# EAGLE design MySens-easyESP32-013 (EAGLE 7.6.0)
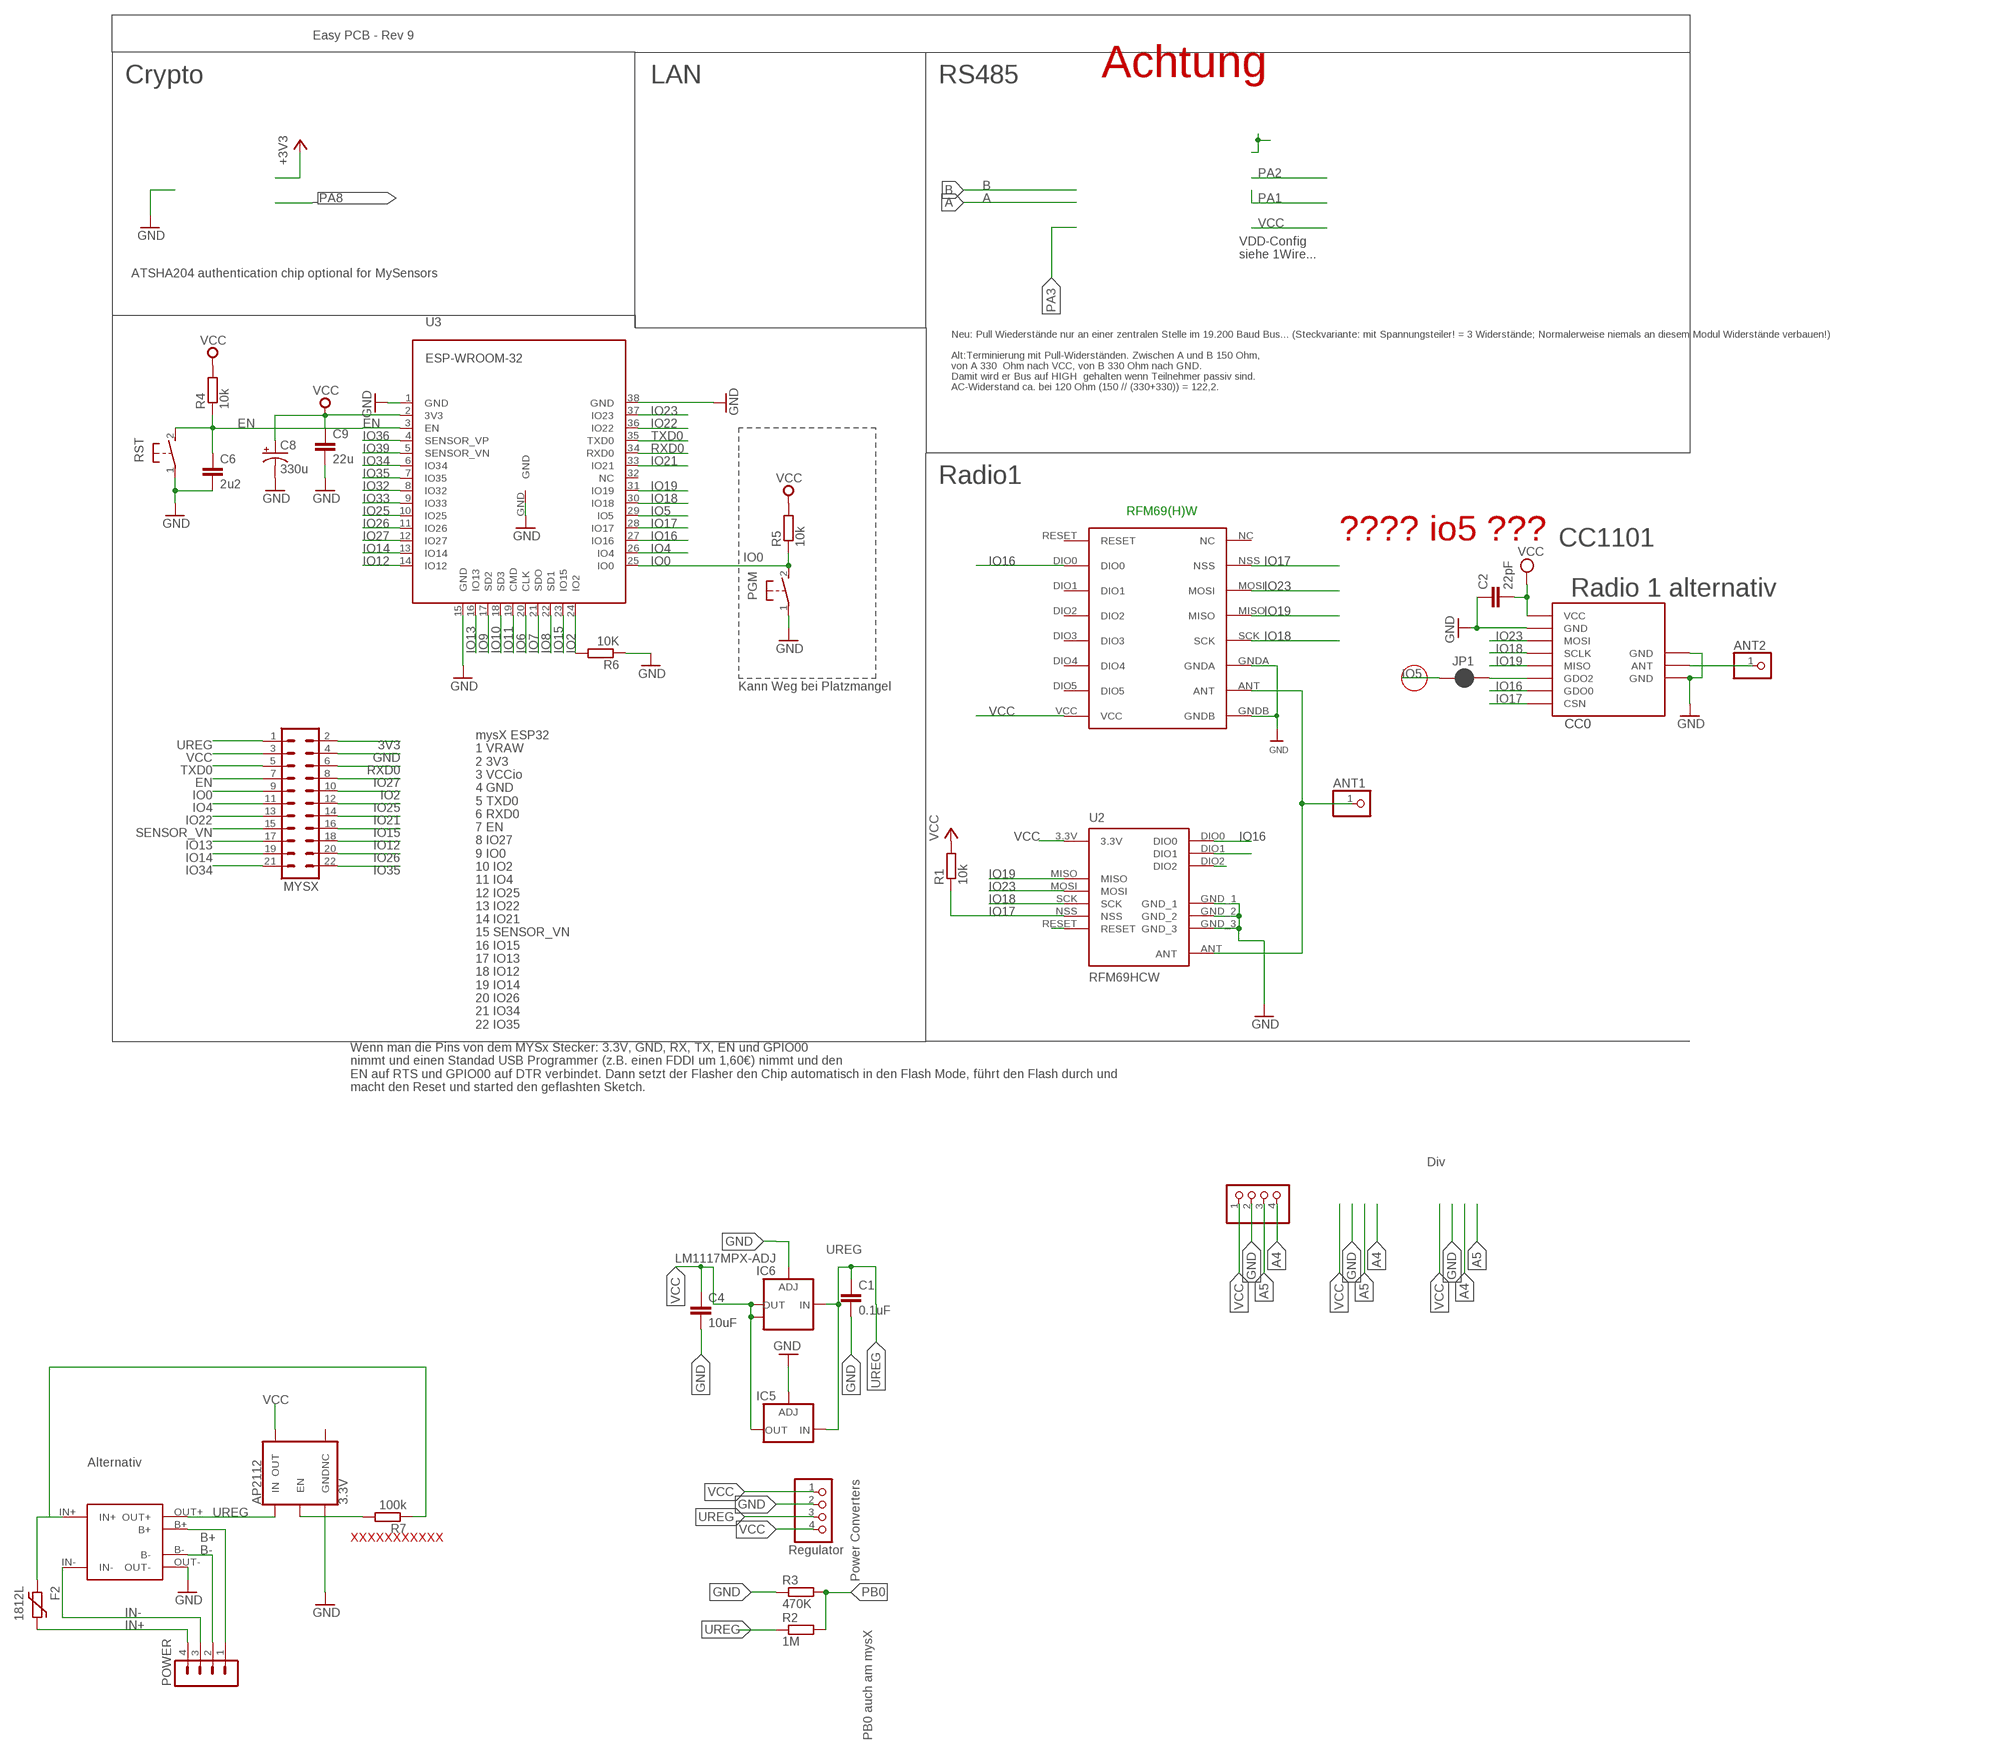
[diagram p0: schematic, sheet 1]

## Parts
ANT1  PINHD-1X1  [1X01]
ANT2  PINHD-1X1  [1X01]
AP2112  3.3V  V_REG_AP2112K-3.3V  [SOT23-5]
C1  0.1uF  C-EUC1206  [C1206]
C2  22pF  C-EUC0805  [C0805]
C4  10uF  C-EUC1210  [C1210]
C6  2u2  C-EUC0603  [C0603]
C8  330u  CAP_POLSMD  [VISHAY_C]
C9  22u  CAP0805  [0805]
CC0  CC1101  CC1101_MODULE1SMD  [CC1101_MODULE1_SMD]
F2  1812L  [1812L]
I2C-1  PINHD-1X04_2.54-S  [1X04-S]
IC5  LD117ADT50TR  [DPACK]
IC6  LM1117MPX-ADJ  [SOT223]
JP1  JUMPER-SMT_2_NC_PASTE_NO-SILK  [SMT-JUMPER_2_NC_PASTE_NO-SILK]
MYSX  MA11-2  [MA11-2]
PGM  DTSM-3  [DTSM-3]
POWER  MA04-1  [MA04-1]
R1  10k  R-EU_M0805  [M0805]
R2  1M  R-EU_R0805  [R0805]
R3  470K  R-EU_R0805  [R0805]
R4  10k  R-EU_R0603  [R0603]
R5  10k  R-EU_R0603  [R0603]
R6  10K  R-EU_R0603  [R0603]
R7  100k  R-EU_M0805  [M0805]
RFM69W1  RFM69HW  [RFM]
RST  DTSM-3  [DTSM-3]
STEPDWN  PINHD-1X04_2.54-S  [1X04-S]
TP4056  TP4056-MODULE  [TP4056-LITHIUM-PROTECTED-MODULE]
U2  RFM69HCW  [RFM69HCW-XXXS2]
U3  ESP-WROOM-32  [ESP-WROOM-32]

## Nets
3V3: MYSX.2 ; supply symbol labelled +3V3
A4: I2C-1.4
A5: I2C-1.3
ANT0: ANT2.1 CC0.ANT
ANT1: ANT1.1 RFM69W1.ANT U2.ANT
B+ [vcc]: POWER.1 TP4056.B+
B- [gnd]: POWER.2 TP4056.B-
EN: C6.1 MYSX.7 R4.1 RST.2 U3.3(EN)
GND [gnd]: AP2112.2(GND) C1.2 C2.1 C4.2 C6.2 C8.- C9.2 CC0.GND@0(GND) CC0.GND@1(GND) CC0.GND@2(GND) I2C-1.2 IC5.1(ADJ) IC6.1(ADJ) MYSX.4 PGM.1 R3.1 R6.1 RFM69W1.GNDA RFM69W1.GNDB RST.1 STEPDWN.2 TP4056.OUT- U2.GND_1 U2.GND_2 U2.GND_3 U3.1(GND) U3.15(GND) U3.38(GND) U3.GND
IN+ [vcc]: F2.P$2 POWER.4
IN- [gnd]: POWER.3 TP4056.IN-
IO0: MYSX.9 PGM.2 R5.1 U3.25(IO0)
IO2: MYSX.10 R6.2 U3.24(IO2)
IO4: MYSX.11 U3.26(IO4)
IO5: JP1.1 U3.29(IO5)
IO6: U3.20(CLK)
IO7: U3.21(SDO)
IO8: U3.22(SD1)
IO9: U3.17(SD2)
IO10: U3.18(SD3)
IO11: U3.19(CMD)
IO12: MYSX.18 U3.14(IO12)
IO13: MYSX.17 U3.16(IO13)
IO14: MYSX.19 U3.13(IO14)
IO15: MYSX.16 U3.23(IO15)
IO16: CC0.GDO0 RFM69W1.DIO0 U2.DIO0 U3.27(IO16)
IO17: CC0.CSN R1.1 RFM69W1.NSS U2.NSS U3.28(IO17)
IO18: CC0.SCLK RFM69W1.SCK U2.SCK U3.30(IO18)
IO19: CC0.MISO RFM69W1.MISO U2.MISO U3.31(IO19)
IO21: MYSX.14 U3.33(IO21)
IO22: MYSX.13 U3.36(IO22)
IO23: CC0.MOSI RFM69W1.MOSI U2.MOSI U3.37(IO23)
IO25: MYSX.12 U3.10(IO25)
IO26: MYSX.20 U3.11(IO26)
IO27: MYSX.8 U3.12(IO27)
IO32: U3.8(IO32)
IO33: U3.9(IO33)
IO34: MYSX.21 U3.6(IO34)
IO35: MYSX.22 U3.7(IO35)
IO36: U3.4(SENSOR_VP)
IO39: U3.5(SENSOR_VN)
MAYBE_IO5: CC0.GDO2 JP1.2
N$1: F2.P$1 R7.1 TP4056.IN+
N$4: U2.DIO2
N$8: U2.DIO1
N$9: U2.RESET
N$12: AP2112.3(EN) R7.2
PB0: R2.2 R3.2
RXD0: MYSX.6 U3.34(RXD0)
SENSOR_VN: MYSX.15
TXD0: MYSX.5 U3.35(TXD0)
UREG [gnd]: AP2112.1(IN) C1.1 IC5.3(IN) IC6.3(IN) MYSX.1 R2.1 STEPDWN.3 TP4056.OUT+
VCC [gnd]: AP2112.5(OUT) C2.2 C4.1 C8.+ C9.1 CC0.VCC I2C-1.1 IC5.4(OUT) IC6.2(OUT) IC6.TAB(OUT1) MYSX.3 R1.2 R4.2 R5.2 RFM69W1.VCC STEPDWN.1 STEPDWN.4 U2.3.3V U3.2(3V3)
Unconnected: AP2112.4(NC) RFM69W1.DIO1 RFM69W1.DIO2 RFM69W1.DIO3 RFM69W1.DIO4 RFM69W1.DIO5 RFM69W1.NC RFM69W1.RESET U3.32(NC)

## Notes on the sheet
- Easy PCB - Rev 9
- Crypto | LAN | RS485 | Achtung
- VDD-Config
  siehe 1Wire...
- ATSHA204 authentication chip optional for MySensors
- Neu: Pull Wiederstände nur an einer zentralen Stelle im 19.200 Baud Bus... (Steckvariante: mit Spannungsteiler! = 3 Widerstände; Normalerweise niemals an diesem Modul Widerstände verbauen!)
  
  Alt:Terminierung mit Pull-Widerständen. Zwischen A und B 150 Ohm,
  von A 330  Ohm nach VCC, von B 330 Ohm nach GND. 
  Damit wird er Bus auf HIGH  gehalten wenn Teilnehmer passiv sind.
  AC-Widerstand ca. bei 120 Ohm (150 // (330+330)) = 122,2.
- Radio1
- RFM69(H)W
- ???? io5 ??? | CC1101
- Radio 1 alternativ
- Kann Weg bei Platzmangel
- mysX ESP32
  1 VRAW
  2 3V3
  3 VCCio
  4 GND
  5 TXD0
  6 RXD0
  7 EN
  8 IO27
  9 IO0
  10 IO2
  11 IO4
  12 IO25
  13 IO22
  14 IO21
  15 SENSOR_VN
  16 IO15
  17 IO13
  18 IO12
  19 IO14
  20 IO26
  21 IO34
  22 IO35
- Wenn man die Pins von dem MYSx Stecker: 3.3V, GND, RX, TX, EN und GPIO00
  nimmt und einen Standad USB Programmer (z.B. einen FDDI um 1,60€) nimmt und den
  EN auf RTS und GPIO00 auf DTR verbindet. Dann setzt der Flasher den Chip automatisch in den Flash Mode, führt den Flash durch und
  macht den Reset und started den geflashten Sketch.
- Div
- Alternativ
- Power Converters
- XXXXXXXXXXX
- Regulator
- PB0 auch am mysX

## Library data of the parts
ANT1 ANT2 = pinhead:PINHD-1X1: PIN HEADER
AP2112 = SparkFun-IC-Power:V_REG_AP2112: AP2112 - 600mA CMOS LDO Regulator w/ Enable The AP2112 is CMOS process low dropout linear regulator with enable function, the regulator delivers a guaranteed 600mA (min.) continuous load current. Features Output Voltage Accuracy: ±1.5% Output Current: 600mA (Min.) Foldback Short Current Protection: 50mA Enable Function to Turn ON/OFF VOUT Low Dropout Voltage (3.3V): 250mV (Typ.) @IOUT=600mA Excellent Load Regulation: 0.2%/A (Typ.) Excellent Line Regulation: 0.02%/V (Typ.) Low Quiescent Current: 55μA (Typ.) Low Standby Current: 0.01μA (Typ.) Low Output Noise: 50μVRMS PSRR: 100Hz -65dB, 1kHz -65dB OTSD Protection Stable with 1.0μF Flexible Cap: Ceramic, Tantalum and Aluminum Electrolytic Operation Temperature Range: -40°C to 85°C ESD: MM 400V, HBM 4000V; PROD_ID: VREG-12457
C1 C2 C4 C6 = rcl:C-EU: CAPACITOR, European symbol
C8 = SparkFun-Passives:CAP_POL: Capacitor Polarized These are standard SMD and PTH capacitors. Normally 10uF, 47uF, and 100uF in electrolytic and tantalum varieties. Always verify the external diameter of the through hole cap, it varies with capacity, voltage, and manufacturer. The EIA devices should be standard.
C9 = SparkFun-Passives:CAP: Capacitor Standard 0603 ceramic capacitor, and 0.1" leaded capacitor.
CC0 = wireless:CC1101_MODULE1: CC1101 wireless module for 433/868 MHz (sold from Aliexpress). DIL version for mounting with pin header (and SMD soldering) and SMD only variant available.
F2 = ptc-littlefuse:1812L
I2C-1 STEPDWN = pinhead-2:PINHD-1X04: PIN HEADER
IC5 = v-reg:LD117A?*: Low drop fixed and adjustable positive voltage regulators 1 A Source: http://www.st.com/stonline/products/literature/ds/7194/ld1117axx.pdf
IC6 = lm1117:LM1117MPX-ADJ
JP1 = SparkFun-Jumpers:JUMPER-SMT_2_NC_PASTE: Normally closed solder jumper This jumper has an aperture in the stencil to allow solder paste to bridge the split in the wire so it's normally closed (NC). Wick off the solder to open the connection. Reapply solder to reclose the connection.
MYSX = con-Pinheader:MA11-2: PIN HEADER; OC_FARNELL: unknown; OC_NEWARK: unknown
PGM RST = switch-tact:DTSM-3
POWER = con-lstb:MA04-1: PIN HEADER; OC_FARNELL: unknown; OC_NEWARK: unknown
R1-R7 = rcl:R-EU_: RESISTOR, European symbol
RFM69W1 = hoperf:RFM69HW
TP4056 = tp2112-usw-V2:TP4056-MODULE
U2 = doug:RFM69H
U3 = esp32:ESP-WROOM-32

## Net classes
0 default: width 0.305 mm, clearance 0.205 mm
1 gnd: width 0.457 mm, drill 0.635 mm, clearance 0.254 mm
2 vcc: width 0.406 mm, drill 0.406 mm, clearance 0.254 mm

## Board
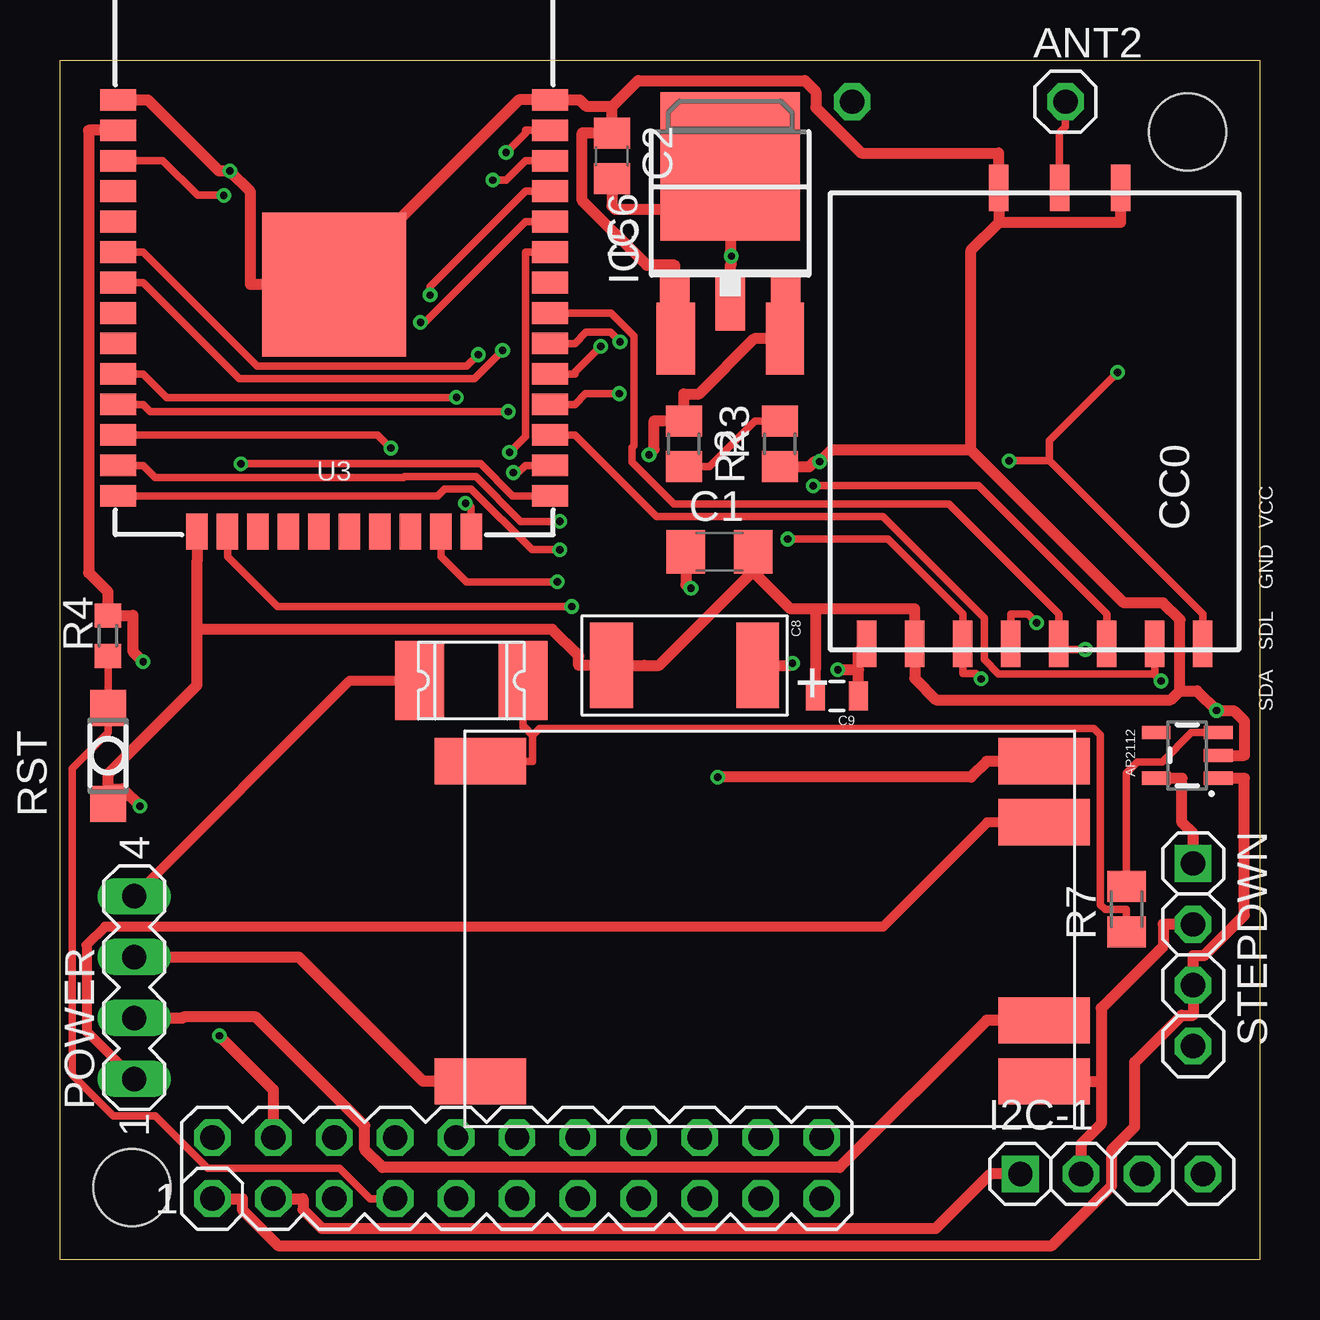
[diagram p1: board, top side]
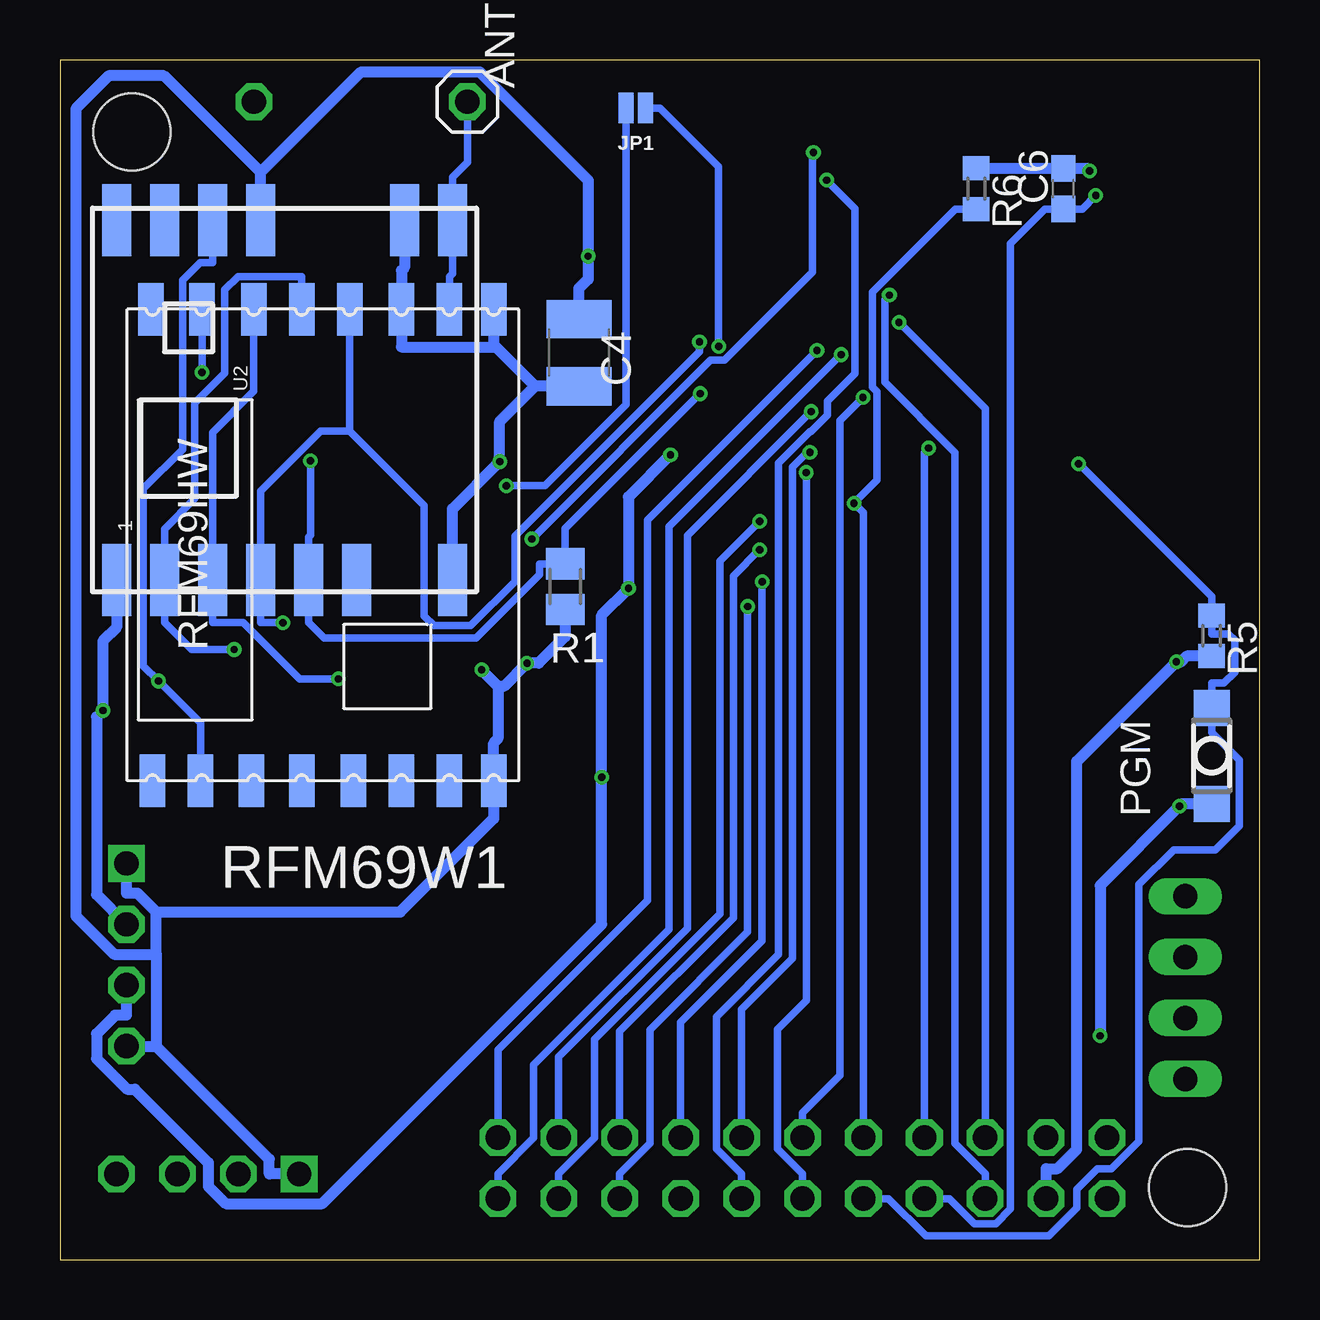
[diagram p2: board, bottom side, seen from below]

Size 50 x 50 mm. Coordinates in mm from the lower left corner, seen from the top.
Outline: 0,0 0,50 50,50 50,0 0,0
Copper layers (1*16): Top 0.035mm / dielectric 1.5mm / Bottom 0.035mm
Design rules "dirt_cheap_dirty_boards.v1": minimum track width 5mil, minimum drill 12mil, track to track 5mil, track to pad 5mil, pad to pad 5mil, via to via 5mil, smd to smd 0mil, copper to edge 10mil, drill to drill 10mil, minimum pad ring 10mil, minimum via ring 6mil, stop-mask expansion 2mil, vias tented up to drill 25mil, thermal gap 10mil
Holes 3.2 mm at 3,3 47,47

### Footprints (pad centres in the part's own frame; a part is rotated, then mirrored left to right if it is on the bottom)
1X01 = drill 1.016 octagon: 1 0,0
SOT23-5 = smd 0.55 x 1.2: 1 -0.95,-1.3; 2 0,-1.3; 3 0.95,-1.3; 4 0.95,1.3; 5 -0.95,1.3
C1206 = smd 1.6 x 1.8: 1 -1.4,0; 2 1.4,0
C0805 = smd 1.3 x 1.5: 1 -0.95,0; 2 0.95,0
C1210 = smd 1.6 x 2.7: 1 -1.4,0; 2 1.4,0
C0603 = smd 1.1 x 1: 1 -0.85,0; 2 0.85,0
VISHAY_C = smd 3.556 x 1.778: + 0,3.048; - 0,-3.048
0805 = smd 0.8 x 1.2: 1 -0.9,0; 2 0.9,0
CC1101_MODULE1_SMD = smd 1.93 x 0.813: ANT 19,5.96; CSN 0,0; GDO0 0,2; GDO2 0,4; GND@0 0,12; GND@1 19,8.5; GND@2 19,3.42; MISO 0,6; MOSI 0,10; SCLK 0,8; VCC 0,14
1812L = smd 2.03 x 3.3: P$1 -2.16,0; P$2 2.16,0
1X04-S = drill 1.016 square: 1 -3.81,0 | drill 1.016 octagon: 2 -1.27,0; 3 1.27,0; 4 3.81,0
DPACK = smd 1.6 x 3: 1 -2.28,-4.8; 3 2.28,-4.8 | smd 5.8 x 6.2: 4 0,2.38
SOT223 = smd 1.219 x 2.235: 1 -2.311,-3.099; 2 0,-3.099; 3 2.311,-3.099 | smd 3.6 x 2.2: TAB 0,3.099
SMT-JUMPER_2_NC_PASTE_NO-SILK = smd 0.635 x 1.27: 1 -0.406,0; 2 0.406,0
MA11-2 = drill 1.016 octagon: 1 -12.7,-1.27; 2 -12.7,1.27; 3 -10.16,-1.27; 4 -10.16,1.27; 5 -7.62,-1.27; 6 -7.62,1.27; 7 -5.08,-1.27; 8 -5.08,1.27; 9 -2.54,-1.27; 10 -2.54,1.27; 11 0,-1.27; 12 0,1.27; 13 2.54,-1.27; 14 2.54,1.27; 15 5.08,-1.27; 16 5.08,1.27; 17 7.62,-1.27; 18 7.62,1.27; 19 10.16,-1.27; 20 10.16,1.27; 21 12.7,-1.27; 22 12.7,1.27
DTSM-3 = smd 1.5 x 1.5: 1 -2,0; 2 2,0
MA04-1 = drill 1.016 long: 1 -3.81,0; 2 -1.27,0; 3 1.27,0; 4 3.81,0
M0805 = smd 1.3 x 1.6: 1 -0.95,0; 2 0.95,0
R0805 = smd 1.3 x 1.5: 1 -0.95,0; 2 0.95,0
R0603 = smd 1 x 1.1: 1 -0.85,0; 2 0.85,0
RFM = smd 2.184 x 1.067: ANT 19.651,2.889; DIO0 0,13.27; DIO1 0,11.143; DIO2 0,9.047; DIO3 0,6.889; DIO4 0,4.889; DIO5 0,2.889; GNDA 19.651,4.889; GNDB 19.651,1.048; MISO 19.651,9.047; MOSI 19.651,11.047; NC 19.651,15.334; NSS 19.651,13.206; RESET 0,15.27; SCK 19.651,7.048; VCC 0,1.048
TP4056-LITHIUM-PROTECTED-MODULE = smd 3.81 x 1.93: B+ 11.43,4.445; B- 11.43,-3.81; IN+ -12.065,6.985; IN- -12.065,-6.35; OUT+ 11.43,6.985; OUT- 11.43,-6.35
RFM69HCW-XXXS2 = smd 3 x 1.2: 3.3V 7.5,1; ANT 7.5,-7; DIO0 7.5,3; DIO1 7.5,5; DIO2 7.5,7; GND_1 7.5,-5; GND_2 -7.5,-7; GND_3 -7.5,7; MISO -7.5,5; MOSI -7.5,3; NSS -7.5,-1; RESET -7.5,-3; SCK -7.5,1
ESP-WROOM-32 = smd 0.9 x 1.5: 1 7.7,9; 2 6.43,9; 3 5.16,9; 4 3.89,9; 5 2.62,9; 6 1.35,9; 7 0.08,9; 8 -1.19,9; 9 -2.46,9; 10 -3.73,9; 11 -5,9; 12 -6.27,9; 13 -7.54,9; 14 -8.81,9; 25 -8.81,-9; 26 -7.54,-9; 27 -6.27,-9; 28 -5,-9; 29 -3.73,-9; 30 -2.46,-9; 31 -1.19,-9; 32 0.08,-9; 33 1.35,-9; 34 2.62,-9; 35 3.89,-9; 36 5.16,-9; 37 6.43,-9; 38 7.7,-9 | smd 1.5 x 0.9: 15 -10.3,5.715; 16 -10.3,4.445; 17 -10.3,3.175; 18 -10.3,1.905; 19 -10.3,0.635; 20 -10.3,-0.635; 21 -10.3,-1.905; 22 -10.3,-3.175; 23 -10.3,-4.445; 24 -10.3,-5.715 | smd 6 x 6: GND 0,0

### Placement (x,y rotation side)
ANT1  33.02,48.26 0 bottom
ANT2  41.91,48.26 0 top
AP2112  46.98,21.02 90 top
C1  27.49,29.5 0 top
C2  23,46 270 top
C4  28.36,37.8 270 bottom
C6  8.18,44.63 90 bottom
C8  26.04,24.77 270 top
C9  32.38,23.5 180 top
CC0  47.62,25.67 90 top
F2  17.14,24.13 180 top
I2C-1  43.84,3.57 0 top
IC5  27.94,43.18 0 top
IC6  27.94,42.94 0 top
JP1  26,48 180 bottom
MYSX  19.05,3.81 0 top
PGM  2,21 90 bottom
POWER  3.1,11.34 90 top
R1  28.94,28.05 270 bottom
R2  26,34 270 top
R3  30,34 90 top
R4  2,26 90 top
R5  2,26 270 bottom
R6  11.81,44.63 270 bottom
R7  44.45,14.61 90 top
RFM69W1  30.88,19.95 90 bottom
RST  2,21 90 top
STEPDWN  47.23,12.7 270 top
TP4056  29.59,13.78 0 top
U2  40.64,35.83 90 bottom
U3  11.43,40.64 90 top

### Tracks (layer width: path | path; a pad name or v marks a point on that pad's centre or on a via)
ANT0
  Top 0.305: ANT2.1 41.91,47.22 41.66,46.97 CC0.ANT
ANT1
  Bottom 0.305: ANT1.1 33.02,45.73 33.64,45.11 U2.ANT 33.64,41.1 33.76,40.98 RFM69W1.ANT
B+
  Top 0.406: POWER.1 1.11,9.51 1.11,13.11 1.88,13.88 34.3,13.88 38.65,18.23 TP4056.B+
B-
  Top 0.457: POWER.2 5.1,10.06 5.15,10.11 8.16,10.11 12.7,5.58 12.7,4.58 13.45,3.83 32.49,3.83 38.63,9.97 TP4056.B-
EN  (via drill 0.3 pad 0.61)
  Top 0.305: U3.3 4.29,45.8 5.73,44.35 v6.83,44.35 | R4.1 RST.2 2,21.97 0.5,20.47 0.5,7.7 2.22,5.99 3.97,5.99 6.15,3.81 11.66,3.81 12.93,2.54 MYSX.7
  Bottom 0.305: v6.83,44.35 7.4,43.78 C6.1 8.95,43.78 10.39,42.35 10.39,2.1 10.99,1.5 11.89,1.5 12.93,2.54 MYSX.7
GND  (via drill 0.3 pad 0.61)
  Top 0.457: 23,48.04 24.1,49.14 31.04,49.14 31.5,48.68 31.5,48.02 33.4,46.12 39.12,46.12 CC0.GND@1 39.12,43.22 | 23,48.04 23,48.08 21.92,48.08 21.66,48.34 U3.38 19.13,48.34 U3.GND 7.95,40.64 7.95,44.5 v7.08,45.37 6.63,45.37 3.66,48.34 U3.1 | 23,48.04 23,48 23,47.87 C2.1 21.77,46.95 21.77,44.14 24.47,41.44 25.63,41.44 IC6.1 25.66,39.81 IC5.1 | 37.98,33.75 37.98,42.07 39.12,43.22 | 39.12,43.22 44.2,43.22 CC0.GND@2 | 37.98,33.75 32.16,33.75 v31.67,33.26 31.44,33.26 31.23,33.05 R3.1 | 46.68,23.71 46.68,26.67 45.98,27.37 44.35,27.37 37.98,33.75 | 46.68,23.71 47.39,23.71 v48.21,22.88 48.92,22.88 49.37,22.44 49.37,21.02 AP2112.2 | 46.68,23.71 46.3,23.33 36.52,23.33 35.62,24.22 CC0.GND@0 35.62,25.86 35.62,27.12 31.48,27.12 | 31.48,27.12 30.45,27.12 28.89,28.68 | 31.48,27.12 31.48,24.58 C9.2 | 28.89,28.68 C1.2 | 28.89,28.68 24.97,24.77 24.36,24.77 C8.- 21.61,24.77 21.61,25.17 20.52,26.27 5.71,26.27 | 5.71,26.27 5.71,29.11 U3.15 | 5.71,26.27 5.71,23.95 2,20.23 2,19.62 | v6.65,9.33 8.89,7.08 MYSX.4 | 2,19.62 2.62,19.62 v3.34,18.9 | RST.1 2,19.62 | STEPDWN.2 45.98,13.97 45.98,13.05 43.4,10.47 43.4,7.43 | I2C-1.2 42.57,4.82 43.4,5.65 43.4,7.43 | TP4056.OUT- 43.4,7.43
  Bottom 0.457: U2.GND_2 33.64,31.29 v31.67,33.26 31.67,34.93 30.2,36.4 | STEPDWN.2 48.48,15.21 48.48,22.62 v48.21,22.88 48.21,25.77 47.64,26.35 U2.GND_3 | v7.08,45.37 7.19,45.48 C6.2 R6.1 | v6.65,9.33 6.65,15.59 v3.34,18.9 3.23,19 RST.1 | 31.92,38.03 35.76,38.03 RFM69W1.GNDA 35.76,41.22 35.64,41.35 U2.GND_1 | RFM69W1.GNDB 31.92,38.03 | 30.2,36.4 31.83,38.03 31.92,38.03 | C4.2 30.2,36.4
IN+
  Top 0.406: POWER.4 12.08,24.13 F2.P$2
IN-
  Top 0.457: POWER.3 5.1,12.61 9.96,12.61 15.13,7.43 TP4056.IN-
IO0  (via drill 0.3 pad 0.61)
  Top 0.305: v7.54,33.17 17.53,33.17 18.87,31.83 U3.25
  Bottom 0.305: v7.54,33.17 2,27.63 R5.1 2,26.07 1.29,26.07 1.04,25.82 1.04,24.48 1.49,24.03 2,24.03 PGM.2 2,21.97 0.84,20.81 0.84,18.08 1.84,17.08 3.58,17.08 5.03,15.63 5.03,4.93 6.17,3.79 6.76,3.79 7.62,2.93 7.62,2.15 8.78,0.99 13.92,0.99 15.47,2.54 MYSX.9
IO2  (via drill 0.3 pad 0.61)
  Top 0.305: v16.9,31.53 17.06,31.37 17.14,31.37 U3.24
  Bottom 0.305: R6.2 12.67,43.78 16.13,40.33 16.13,36.35 15.94,36.17 15.94,32.49 v16.9,31.53 16.51,31.13 16.51,6.12 MYSX.10
IO4  (via drill 0.3 pad 0.61)
  Top 0.305: v18.89,32.8 19.1,32.8 19.4,33.1 U3.26
  Bottom 0.305: MYSX.11 19.05,3.58 20.09,4.62 20.09,9.6 18.89,10.8 v18.89,32.8
IO5  (via drill 0.3 pad 0.61)
  Top 0.305: U3.29 21.46,36.91 21.46,36.98 v22.55,38.07
  Bottom 0.305: JP1.1 25,48 22.55,45.55 v22.55,38.07
IO12  (via drill 0.3 pad 0.61)
  Top 0.305: v20.84,29.59 19.67,29.59 17.14,32.11 16.03,32.11 15.75,31.83 3.46,31.83 U3.14
  Bottom 0.305: v20.84,29.59 21.93,28.49 21.93,14.24 26.67,9.5 26.67,6.12 MYSX.18
IO13  (via drill 0.3 pad 0.61)
  Top 0.305: U3.16 6.99,29.31 9.08,27.22 v21.33,27.22
  Bottom 0.305: MYSX.17 26.67,3.58 25.4,4.85 25.4,9.58 21.33,13.65 v21.33,27.22
IO14  (via drill 0.3 pad 0.61)
  Top 0.305: v20.84,30.77 19.21,30.77 17.35,32.62 14.36,32.62 14.32,32.58 3.98,32.58 3.46,33.1 U3.13
  Bottom 0.305: v20.84,30.77 22.5,29.11 22.5,14.4 27.71,9.18 27.71,5.08 29.21,3.58 MYSX.19
IO15  (via drill 0.3 pad 0.61)
  Top 0.305: v20.73,28.25 16.94,28.25 15.88,29.31 U3.23
  Bottom 0.305: v20.73,28.25 20.73,13.27 24.13,9.88 MYSX.16
IO16  (via drill 0.3 pad 0.61)
  Top 0.305: 45.6,24.4 39.12,24.4 38.52,25 38.52,26.75 34.29,30.97 24.86,30.97 21.46,34.37 U3.27 | 45.6,24.4 45.62,24.43 CC0.GDO0 | v45.89,24.12 45.6,24.4 | 45.6,24.4
  Bottom 0.305: RFM69W1.DIO0 44.15,22.37 v45.89,24.12 46.52,24.75 46.52,32.14 44.89,33.77 44.89,40.82 44.16,41.55 43.64,41.55 U2.DIO0
IO17  (via drill 0.3 pad 0.61)
  Top 0.305: 41.24,33.3 47.62,26.91 CC0.CSN | v39.56,33.3 41.24,33.3 | 41.24,33.3 41.24,34.14 v44.08,36.98 | v23.32,36.09 21.91,36.09 21.46,35.64 U3.28
  Bottom 0.305: RFM69W1.NSS v44.08,36.98 | v23.32,36.09 28.94,30.47 28.94,29.93 R1.1 30.02,29 30.02,28.55 32.66,25.91 39,25.91 39.64,26.55 U2.NSS 39.64,30.11 39.56,30.19 v39.56,33.3
IO18  (via drill 0.3 pad 0.61)
  Top 0.305: v40.71,26.54 40.34,26.91 39.62,26.91 CC0.SCLK | v23.34,38.25 22.94,38.66 21.93,38.66 21.46,38.18 U3.30
  Bottom 0.305: 37.92,34.54 34.82,31.43 34.82,26.83 34.41,26.42 32.88,26.42 31.04,28.25 31.04,30.15 23.34,37.84 v23.34,38.25 | v40.71,26.54 v40.72,26.55 41.64,26.55 U2.SCK 41.64,32.04 39.14,34.54 37.92,34.54 | 37.92,34.54 37.92,38.23 RFM69W1.SCK
IO19  (via drill 0.3 pad 0.61)
  Top 0.305: U3.31 21.46,39.45 22.97,39.45 23.93,38.49 23.93,33.93 23.84,33.84 23.84,33.25 25.6,31.48 37.06,31.48 41.62,26.91 CC0.MISO 41.87,25.43 v42.74,25.43
  Bottom 0.305: RFM69W1.MISO 39.92,40.98 42.58,40.98 43.13,40.43 43.13,36.95 44.38,35.7 44.38,31.71 45.64,30.45 U2.MISO 45.64,27.57 45.64,26.55 44.52,25.43 v42.74,25.43
IO21  (via drill 0.3 pad 0.61)
  Top 0.305: v18.74,33.64 19.4,34.3 19.4,41.99 U3.33
  Bottom 0.305: v18.74,33.64 18.88,33.64 19.48,33.04 19.48,12.55 21.59,10.44 21.59,6.12 MYSX.14
IO22  (via drill 0.3 pad 0.61)
  Top 0.305: U3.36 19.4,45.8 18.59,44.99 v18.04,44.99
  Bottom 0.305: v18.04,44.99 16.86,43.81 16.86,36.93 18.01,35.78 18.01,35.19 18.7,34.51 18.73,34.51 20.05,33.2 20.05,12.71 22.63,10.12 22.63,4.62 21.59,3.58 MYSX.13
IO23  (via drill 0.3 pad 0.61)
  Top 0.305: v38.4,24.2 38.17,24.43 37.62,24.43 CC0.MOSI 37.62,26.29 37.62,26.91 34.51,30.03 v30.33,30.03 | U3.37 19.4,47.07 19.4,46.95 v18.59,46.14
  Bottom 0.305: v30.33,30.03 22.88,37.48 22.3,37.48 18.63,41.16 18.63,46.11 v18.59,46.14 | v38.4,24.2 40.01,24.2 42.36,26.55 43.64,26.55 U2.MOSI 43.64,34.48 41.92,36.2 RFM69W1.MOSI
IO25  (via drill 0.3 pad 0.61)
  Top 0.305: U3.10 3.46,36.91 4.44,35.93 v16.53,35.93
  Bottom 0.305: MYSX.12 19.05,6.12 17.49,7.68 17.49,34.97 v16.53,35.93
IO26  (via drill 0.3 pad 0.61)
  Top 0.305: U3.11 3.46,35.64 3.75,35.34 v18.69,35.34
  Bottom 0.305: MYSX.20 29.21,8.45 23.85,13.8 23.85,30.18 v18.69,35.34
IO27  (via drill 0.3 pad 0.61)
  Top 0.305: U3.12 13.25,34.37 v13.79,33.82
  Bottom 0.305: v13.79,33.82 13.97,33.65 | 13.97,33.65 | 13.97,33.65 MYSX.8
IO34  (via drill 0.3 pad 0.61)
  Top 0.305: v17.44,37.72 16.96,37.23 8.22,37.23 3.46,41.99 U3.6
  Bottom 0.305: v17.44,37.72 24.62,30.54 24.62,13.76 30.25,8.12 30.25,5.08 31.75,3.58 MYSX.21
IO35  (via drill 0.3 pad 0.61)
  Top 0.305: U3.7 3.46,40.72 7.46,36.72 17.27,36.72 v18.45,37.89
  Bottom 0.305: MYSX.22 31.75,8.74 25.52,14.97 25.52,30.82 v18.45,37.89
MAYBE_IO5  (via drill 0.3 pad 0.61)
  Top 0.305: v31.39,32.25 38.29,32.25 43.62,26.91 CC0.GDO2
  Bottom 0.305: JP1.2 26.41,47.09 26.41,35.63 29.79,32.25 v31.39,32.25
N$1
  Top 0.305: R7.1 44.45,14.58 43.57,14.58 43.37,14.79 43.37,21.86 43.09,22.14 19.99,22.14 19.7,21.85 | 19.7,21.85 19.36,22.2 19.3,22.2 F2.P$1 | 19.7,21.85 19.7,20.77 TP4056.IN+
N$12
  Top 0.305: R7.2 44.45,20.28 44.91,20.75 45.94,20.75 47.16,21.96 AP2112.3
PB0
  Top 0.305: R3.2 28.97,34.95 27.07,33.05 R2.2
RXD0  (via drill 0.3 pad 0.61)
  Top 0.305: v15.03,39.07 15.21,39.07 19.4,43.26 U3.34
  Bottom 0.305: v15.03,39.07 11.43,35.47 11.43,6.12 MYSX.6
TXD0  (via drill 0.3 pad 0.61)
  Top 0.305: v15.43,40.2 15.43,40.55 19.4,44.53 U3.35
  Bottom 0.305: v15.43,40.2 15.61,40.01 15.61,36.56 12.69,33.64 12.69,4.84 11.43,3.58 MYSX.5
UREG  (via drill 0.3 pad 0.61)
  Top 0.457: v24.55,33.54 24.77,33.76 24.77,34.95 R2.1 26,36.08 26.64,36.08 28.94,38.38 IC5.3 30.22,39.81 IC6.3 | C1.1 26.09,28.12 26.16,28.12 v26.3,27.98 | v27.42,20.11 37.97,20.11 38.63,20.77 TP4056.OUT+ | MYSX.1 7.59,2.54 7.59,2.07 9.09,0.58 41.35,0.58 43.84,3.07 43.84,4.57 44.8,5.53 44.8,8.22 46.76,10.19 47.23,10.19 STEPDWN.3 47.23,12.68 47.7,12.68 49.37,14.35 49.37,20.07 AP2112.1
  Bottom 0.457: v24.55,33.54 26.3,31.79 v26.3,27.98 27.42,26.86 v27.42,20.11 27.42,13.97 39.07,2.32 43.09,2.32 43.81,3.05 43.81,4.04 46.88,7.1 47.2,7.1 48.48,8.37 48.48,9.41 47.7,10.19 47.23,10.19 STEPDWN.3
VCC  (via drill 0.3 pad 0.61)
  Top 0.457: AP2112.5 46.77,20.07 46.77,18.22 47.23,17.75 STEPDWN.1 | U3.2 1.2,47.07 1.2,28.64 2,27.83 R4.2 3.03,26.85 3.03,25.35 v3.47,24.91 | I2C-1.1 38.78,3.57 36.51,1.29 10.91,1.29 10.13,2.07 10.13,2.54 MYSX.3 | C2.2 23,43.92 23.15,43.77 27.94,43.77 | 27.94,43.77 27.94,41.98 27.99,41.93 v27.99,41.82 27.99,41.49 27.94,41.44 IC6.2 | 27.94,43.77 IC5.4 IC6.TAB | 33.28,24.58 33.28,25.33 CC0.VCC | 33.28,24.58 v32.42,24.58 | C9.1 33.28,24.58 | v30.53,24.86 30.45,24.78 30.45,24.77 C8.+
  Bottom 0.457: 45.98,14.49 46.76,15.27 47.23,15.27 STEPDWN.1 | 45.98,12.72 45.98,14.49 | 45.98,14.49 35.81,14.49 31.92,18.38 RFM69W1.VCC 31.92,21.53 31.74,21.71 31.74,23.89 | 41.64,45.31 45.66,49.34 47.97,49.34 49.34,47.97 49.34,14.32 47.75,12.72 45.98,12.72 | 45.98,12.72 45.98,8.89 | STEPDWN.4 45.98,8.89 | I2C-1.1 41.27,3.57 41.27,4.18 45.98,8.89 | MYSX.3 8.89,3.79 8.42,3.79 7.62,4.58 7.62,20.76 v3.47,24.91 3.27,24.91 3.03,25.15 R5.2 | 31.74,23.89 v32.42,24.58 | 31.74,23.89 31.5,23.89 v30.53,24.86 30.05,24.86 28.94,25.97 R1.2 | 41.64,45.31 37.45,49.51 32.51,49.51 27.99,44.99 v27.99,41.82 27.99,40.86 28.36,40.48 C4.1 | U2.3.3V 41.64,45.31

### Text on the board
tNames: easyGW BluePill 0.2 / RS485, RFM69, RFM95 | VCC | GND | SDL | SDA | 5V | UREG | GND | 5V
bNames: PluepillGW V01 / RS485, RFM69, RFM95
Document: DS_1551K